# Altium project matrix_8x8_74hc595.PrjPcb
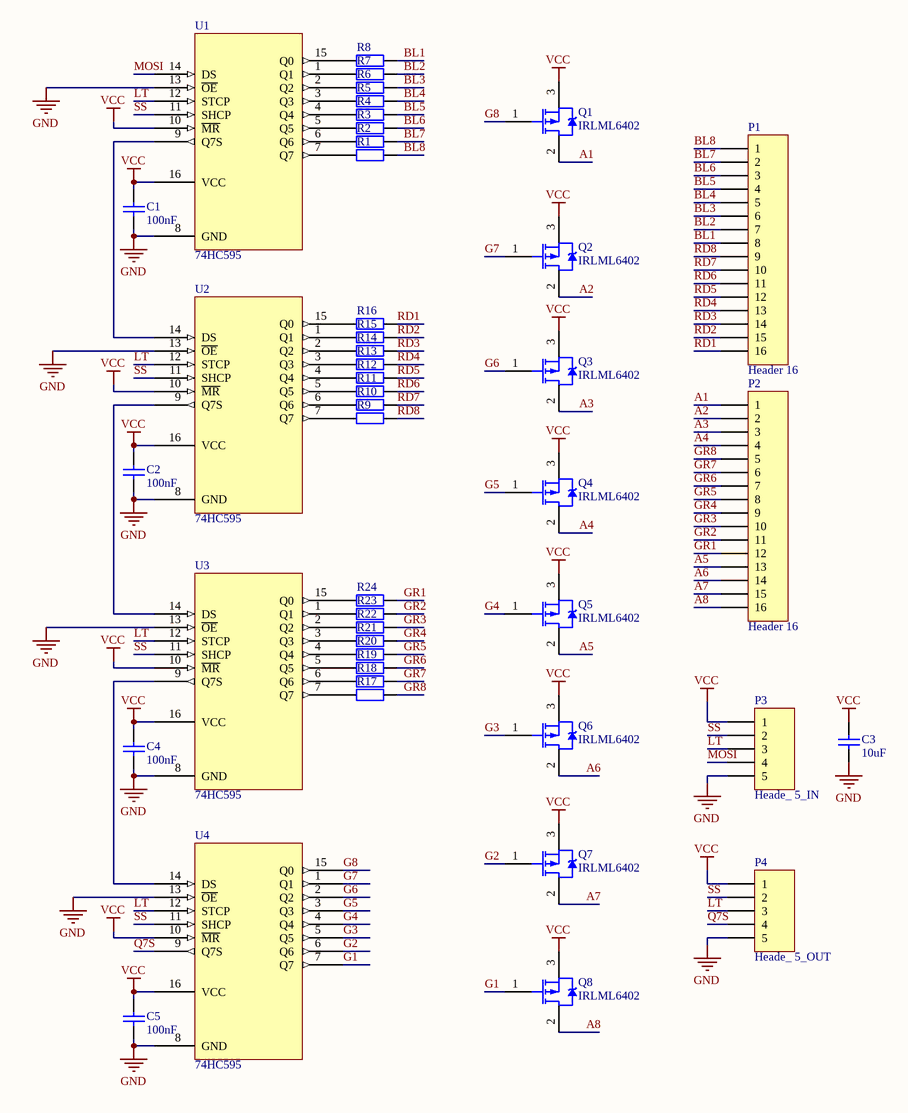
[diagram p0: schematic.SchDoc]
2 sheets, 149 parts. Net scope: global (net labels, ports and power ports of the same name join across sheets).
Board files: BOARD.PcbDoc, PRINT.PcbDoc
Sheets:
  schematic.SchDoc
  matrix_sh.SchDoc

## Sheet schematic.SchDoc
size A3

### Parts
(Parts that share a designator on the sheet are numbered #1, #2 ... from top to bottom, then left to right.)
C1#1  value 100nF  [6-0805_M]  (hidden comment: Cap)
C2#1  value 100nF  [6-0805_M]  (hidden comment: Cap)
C3#1  value 10uF  [6-0805_M]  (hidden comment: Cap)
C4#1  value 100nF  [6-0805_M]  (hidden comment: Cap)
C5  value 100nF  [6-0805_M]  (hidden comment: Cap)
P1  Header 16  [HDR1X16]
P2  Header 16  [HDR1X16]
P3  Heade_ 5_IN  [HDR1X5]
P4  Heade_ 5_OUT  [HDR1X5]
Q1#1  IRLML6402  [SOT95P237X112-3N]
Q2#1  IRLML6402  [SOT95P237X112-3N]
Q3#1  IRLML6402  [SOT95P237X112-3N]
Q4#1  IRLML6402  [SOT95P237X112-3N]
Q5#1  IRLML6402  [SOT95P237X112-3N]
Q6#1  IRLML6402  [SOT95P237X112-3N]
Q7#1  IRLML6402  [SOT95P237X112-3N]
Q8#1  IRLML6402  [SOT95P237X112-3N]
R1#1  Res2  [6-0805_M]  (value not drawn)
R2#1  Res2  [6-0805_M]  (value not drawn)
R3#1  Res2  [6-0805_M]  (value not drawn)
R4#1  Res2  [6-0805_M]  (value not drawn)
R5#1  Res2  [6-0805_M]  (value not drawn)
R6#1  Res2  [6-0805_M]  (value not drawn)
R7#1  Res2  [6-0805_M]  (value not drawn)
R8#1  Res2  [6-0805_M]  (value not drawn)
R9#1  Res2  [6-0805_M]  (value not drawn)
R10#1  Res2  [6-0805_M]  (value not drawn)
R11#1  Res2  [6-0805_M]  (value not drawn)
R12#1  Res2  [6-0805_M]  (value not drawn)
R13#1  Res2  [6-0805_M]  (value not drawn)
R14#1  Res2  [6-0805_M]  (value not drawn)
R15#1  Res2  [6-0805_M]  (value not drawn)
R16#1  Res2  [6-0805_M]  (value not drawn)
R17#1  Res2  [6-0805_M]  (value not drawn)
R18#1  Res2  [6-0805_M]  (value not drawn)
R19#1  Res2  [6-0805_M]  (value not drawn)
R20#1  Res2  [6-0805_M]  (value not drawn)
R21#1  Res2  [6-0805_M]  (value not drawn)
R22#1  Res2  [6-0805_M]  (value not drawn)
R23#1  Res2  [6-0805_M]  (value not drawn)
R24#1  Res2  [6-0805_M]  (value not drawn)
U1#1  74HC595  [TSOP65P640X110-16M]
U2#1  74HC595  [TSOP65P640X110-16M]
U3#1  74HC595  [TSOP65P640X110-16M]
U4#1  74HC595  [TSOP65P640X110-16M]

### Nets
GND: C1#1.1 C2#1.1 C3#1.1 C4#1.1 C5.1 P3.5 P4.5 U1#1.8(GND) U1#1.13(~{OE}) U2#1.8(GND) U2#1.13(~{OE}) U3#1.8(GND) U3#1.13(~{OE}) U4#1.8(GND) U4#1.13(~{OE})
VCC: C1#1.2 C2#1.2 C3#1.2 C4#1.2 C5.2 P3.1 P4.1 Q1#1.3(S) Q2#1.3(S) Q3#1.3(S) Q4#1.3(S) Q5#1.3(S) Q6#1.3(S) Q7#1.3(S) Q8#1.3(S) U1#1.10(~{MR}) U1#1.16(VCC) U2#1.10(~{MR}) U2#1.16(VCC) U3#1.10(~{MR}) U3#1.16(VCC) U4#1.10(~{MR}) U4#1.16(VCC)
A1: P2.1 Q1#1.2(D)
A2: P2.2 Q2#1.2(D)
A3: P2.3 Q3#1.2(D)
A4: P2.4 Q4#1.2(D)
A5: P2.13 Q5#1.2(D)
A6: P2.14 Q6#1.2(D)
A7: P2.15 Q7#1.2(D)
A8: P2.16 Q8#1.2(D)
BL1: P1.8 R8#1.2
BL2: P1.7 R7#1.2
BL3: P1.6 R6#1.2
BL4: P1.5 R5#1.2
BL5: P1.4 R4#1.2
BL6: P1.3 R3#1.2
BL7: P1.2 R2#1.2
BL8: P1.1 R1#1.2
G1: Q8#1.1(G) U4#1.7(Q7)
G2: Q7#1.1(G) U4#1.6(Q6)
G3: Q6#1.1(G) U4#1.5(Q5)
G4: Q5#1.1(G) U4#1.4(Q4)
G5: Q4#1.1(G) U4#1.3(Q3)
G6: Q3#1.1(G) U4#1.2(Q2)
G7: Q2#1.1(G) U4#1.1(Q1)
G8: Q1#1.1(G) U4#1.15(Q0)
GR1: P2.12 R24#1.2
GR2: P2.11 R23#1.2
GR3: P2.10 R22#1.2
GR4: P2.9 R21#1.2
GR5: P2.8 R20#1.2
GR6: P2.7 R19#1.2
GR7: P2.6 R18#1.2
GR8: P2.5 R17#1.2
LT: P3.3 P4.3 U1#1.12(STCP) U2#1.12(STCP) U3#1.12(STCP) U4#1.12(STCP)
MOSI: P3.4 U1#1.14(DS)
Q7S: P4.4 U4#1.9(Q7S)
RD1: P1.16 R16#1.2
RD2: P1.15 R15#1.2
RD3: P1.14 R14#1.2
RD4: P1.13 R13#1.2
RD5: P1.12 R12#1.2
RD6: P1.11 R11#1.2
RD7: P1.10 R10#1.2
RD8: P1.9 R9#1.2
SS: P3.2 P4.2 U1#1.11(SHCP) U2#1.11(SHCP) U3#1.11(SHCP) U4#1.11(SHCP)
NetR1#1_1: R1#1.1 U1#1.7(Q7)
NetR2#1_1: R2#1.1 U1#1.6(Q6)
NetR3#1_1: R3#1.1 U1#1.5(Q5)
NetR4#1_1: R4#1.1 U1#1.4(Q4)
NetR5#1_1: R5#1.1 U1#1.3(Q3)
NetR6#1_1: R6#1.1 U1#1.2(Q2)
NetR7#1_1: R7#1.1 U1#1.1(Q1)
NetR8#1_1: R8#1.1 U1#1.15(Q0)
NetR9#1_1: R9#1.1 U2#1.7(Q7)
NetR10#1_1: R10#1.1 U2#1.6(Q6)
NetR11#1_1: R11#1.1 U2#1.5(Q5)
NetR12#1_1: R12#1.1 U2#1.4(Q4)
NetR13#1_1: R13#1.1 U2#1.3(Q3)
NetR14#1_1: R14#1.1 U2#1.2(Q2)
NetR15#1_1: R15#1.1 U2#1.1(Q1)
NetR16#1_1: R16#1.1 U2#1.15(Q0)
NetR17#1_1: R17#1.1 U3#1.7(Q7)
NetR18#1_1: R18#1.1 U3#1.6(Q6)
NetR19#1_1: R19#1.1 U3#1.5(Q5)
NetR20#1_1: R20#1.1 U3#1.4(Q4)
NetR21#1_1: R21#1.1 U3#1.3(Q3)
NetR22#1_1: R22#1.1 U3#1.2(Q2)
NetR23#1_1: R23#1.1 U3#1.1(Q1)
NetR24#1_1: R24#1.1 U3#1.15(Q0)
NetU1#1_9: U1#1.9(Q7S) U2#1.14(DS)
NetU2#1_9: U2#1.9(Q7S) U3#1.14(DS)
NetU3#1_9: U3#1.9(Q7S) U4#1.14(DS)

### Library data of the parts
C1#1 C2#1 C3#1 C4#1 C5 = Cap: Capacitor; Published: 8-Jun-2000; LatestRevisionDate: 17-Jul-2002; LatestRevisionNote: Re-released for DXP Platform.; PackageReference: RAD-0.3; Publisher: Altium Limited; PackageDescription: Radial Cap, Thru-Hole; 2 Leads; 0.3 in Pin Spacing
P1 P2 = Header 16: Header, 16-Pin; LatestRevisionDate: 17-Jul-2002; LatestRevisionNote: Re-released for DXP Platform.; Publisher: Altium Limited
P3 P4 = Header 5: Header, 5-Pin; LatestRevisionDate: 17-Jul-2002; LatestRevisionNote: Re-released for DXP Platform.; Publisher: Altium Limited
R1#1 R2#1 R3#1 R4#1 R5#1 R6#1 R7#1 R8#1 R18#1 R19#1 R20#1 R21#1 R22#1 R23#1 R24#1 = Res2: Resistor; Value: 33; Published: 8-Jun-2000; LatestRevisionDate: 17-Jul-2002; LatestRevisionNote: Re-released for DXP Platform.; PackageReference: AXIAL-0.4; Publisher: Altium Limited; PackageDescription: Axial Device, Thru-Hole; 2 Leads; 0.4 in Pin Spacing
R9#1 R10#1 R11#1 R12#1 R13#1 R14#1 R15#1 R16#1 = Res2: Resistor; Value: 130; Published: 8-Jun-2000; LatestRevisionDate: 17-Jul-2002; LatestRevisionNote: Re-released for DXP Platform.; PackageReference: AXIAL-0.4; Publisher: Altium Limited; PackageDescription: Axial Device, Thru-Hole; 2 Leads; 0.4 in Pin Spacing
R17#1 = Res2: Resistor; Value: 30; Published: 8-Jun-2000; LatestRevisionDate: 17-Jul-2002; LatestRevisionNote: Re-released for DXP Platform.; PackageReference: AXIAL-0.4; Publisher: Altium Limited; PackageDescription: Axial Device, Thru-Hole; 2 Leads; 0.4 in Pin Spacing
U1#1 U2#1 U3#1 U4#1 = 74HC595: NXP

## Sheet matrix_sh.SchDoc
size A2 portrait
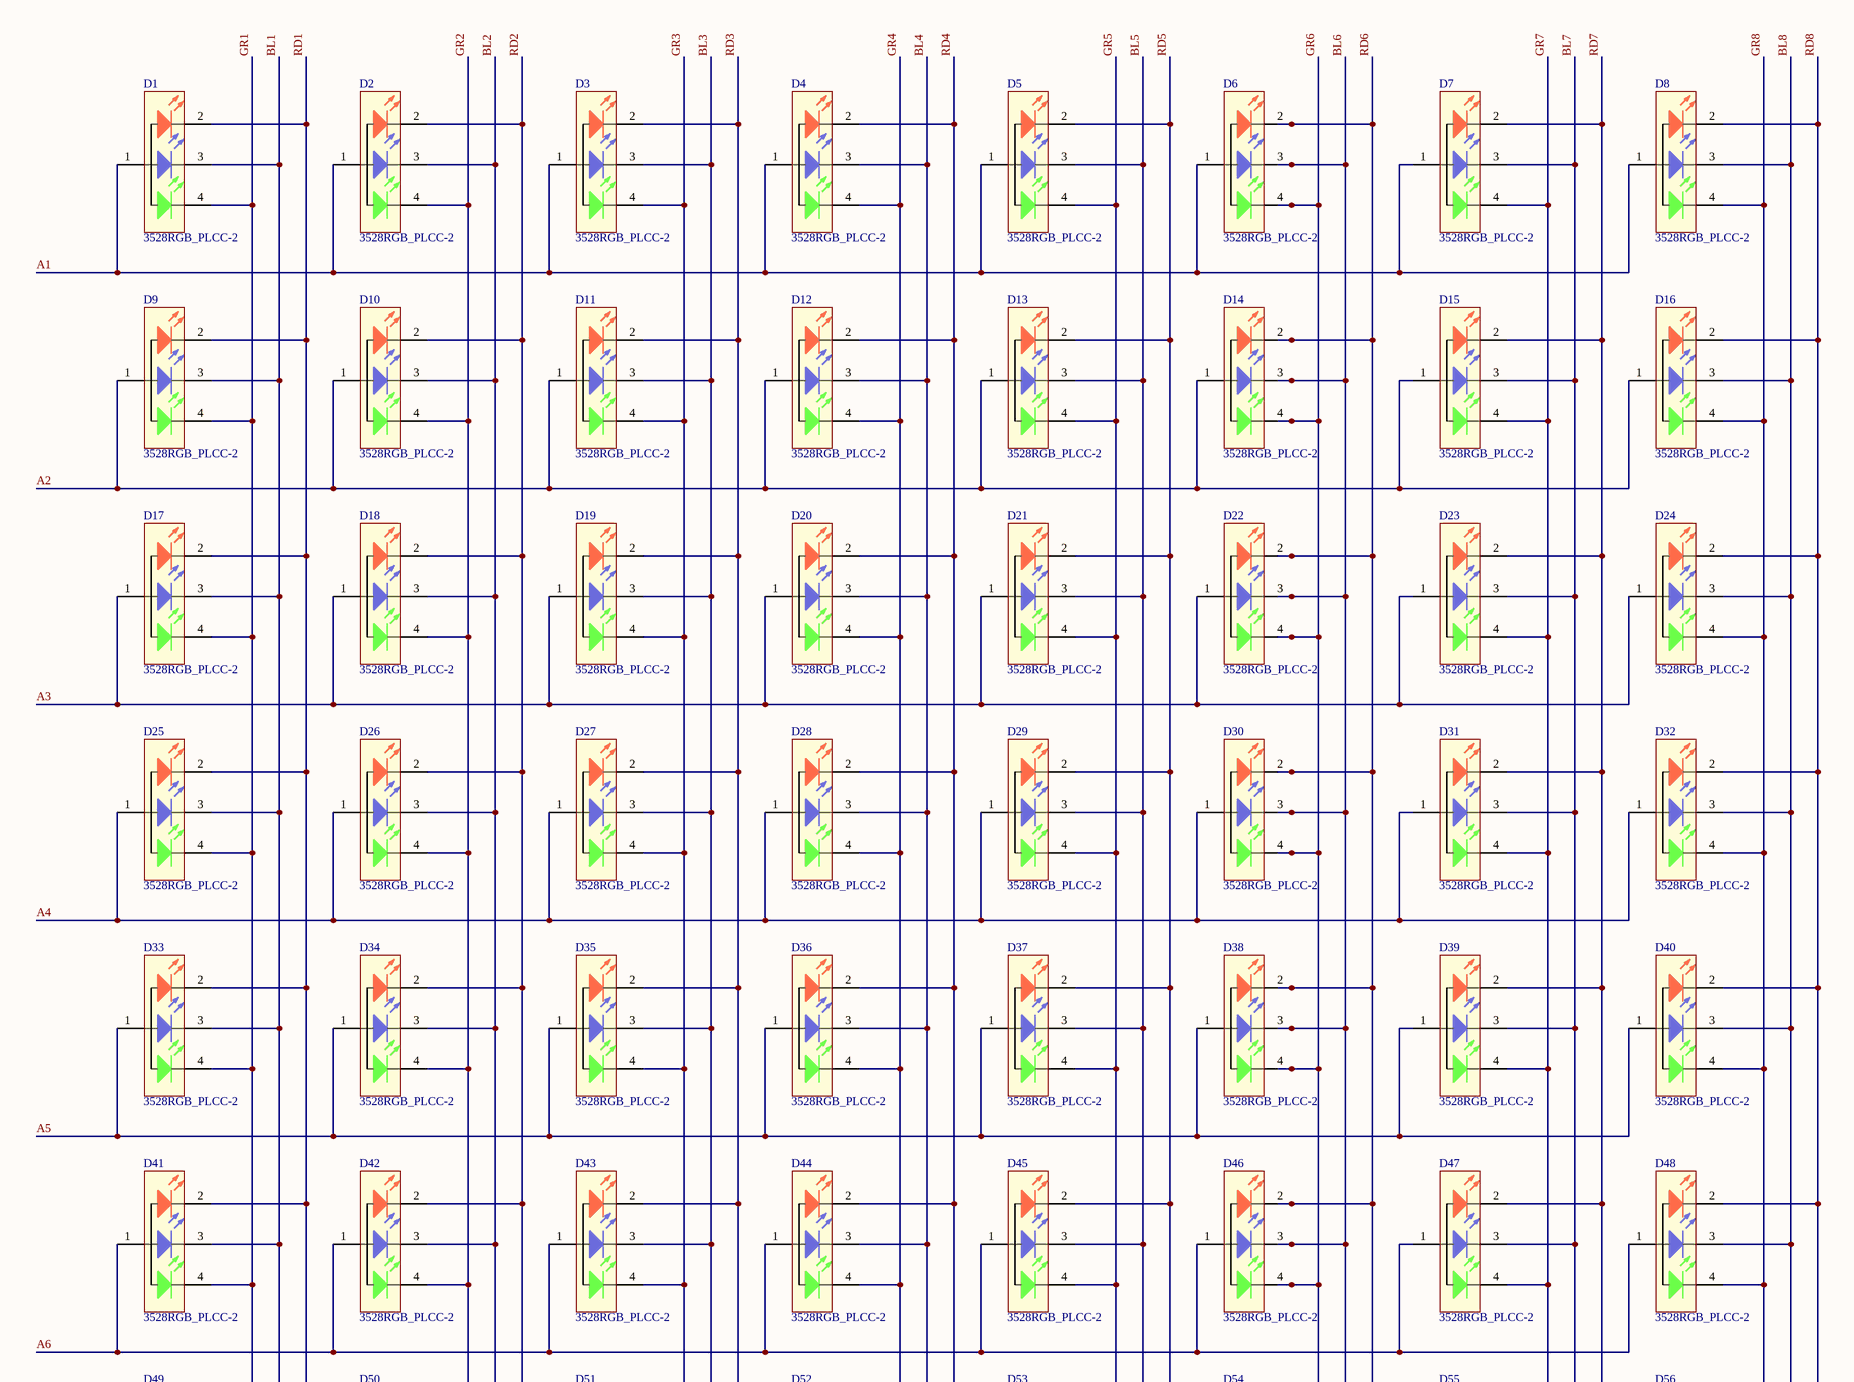
[diagram p1: matrix_sh.SchDoc, top]
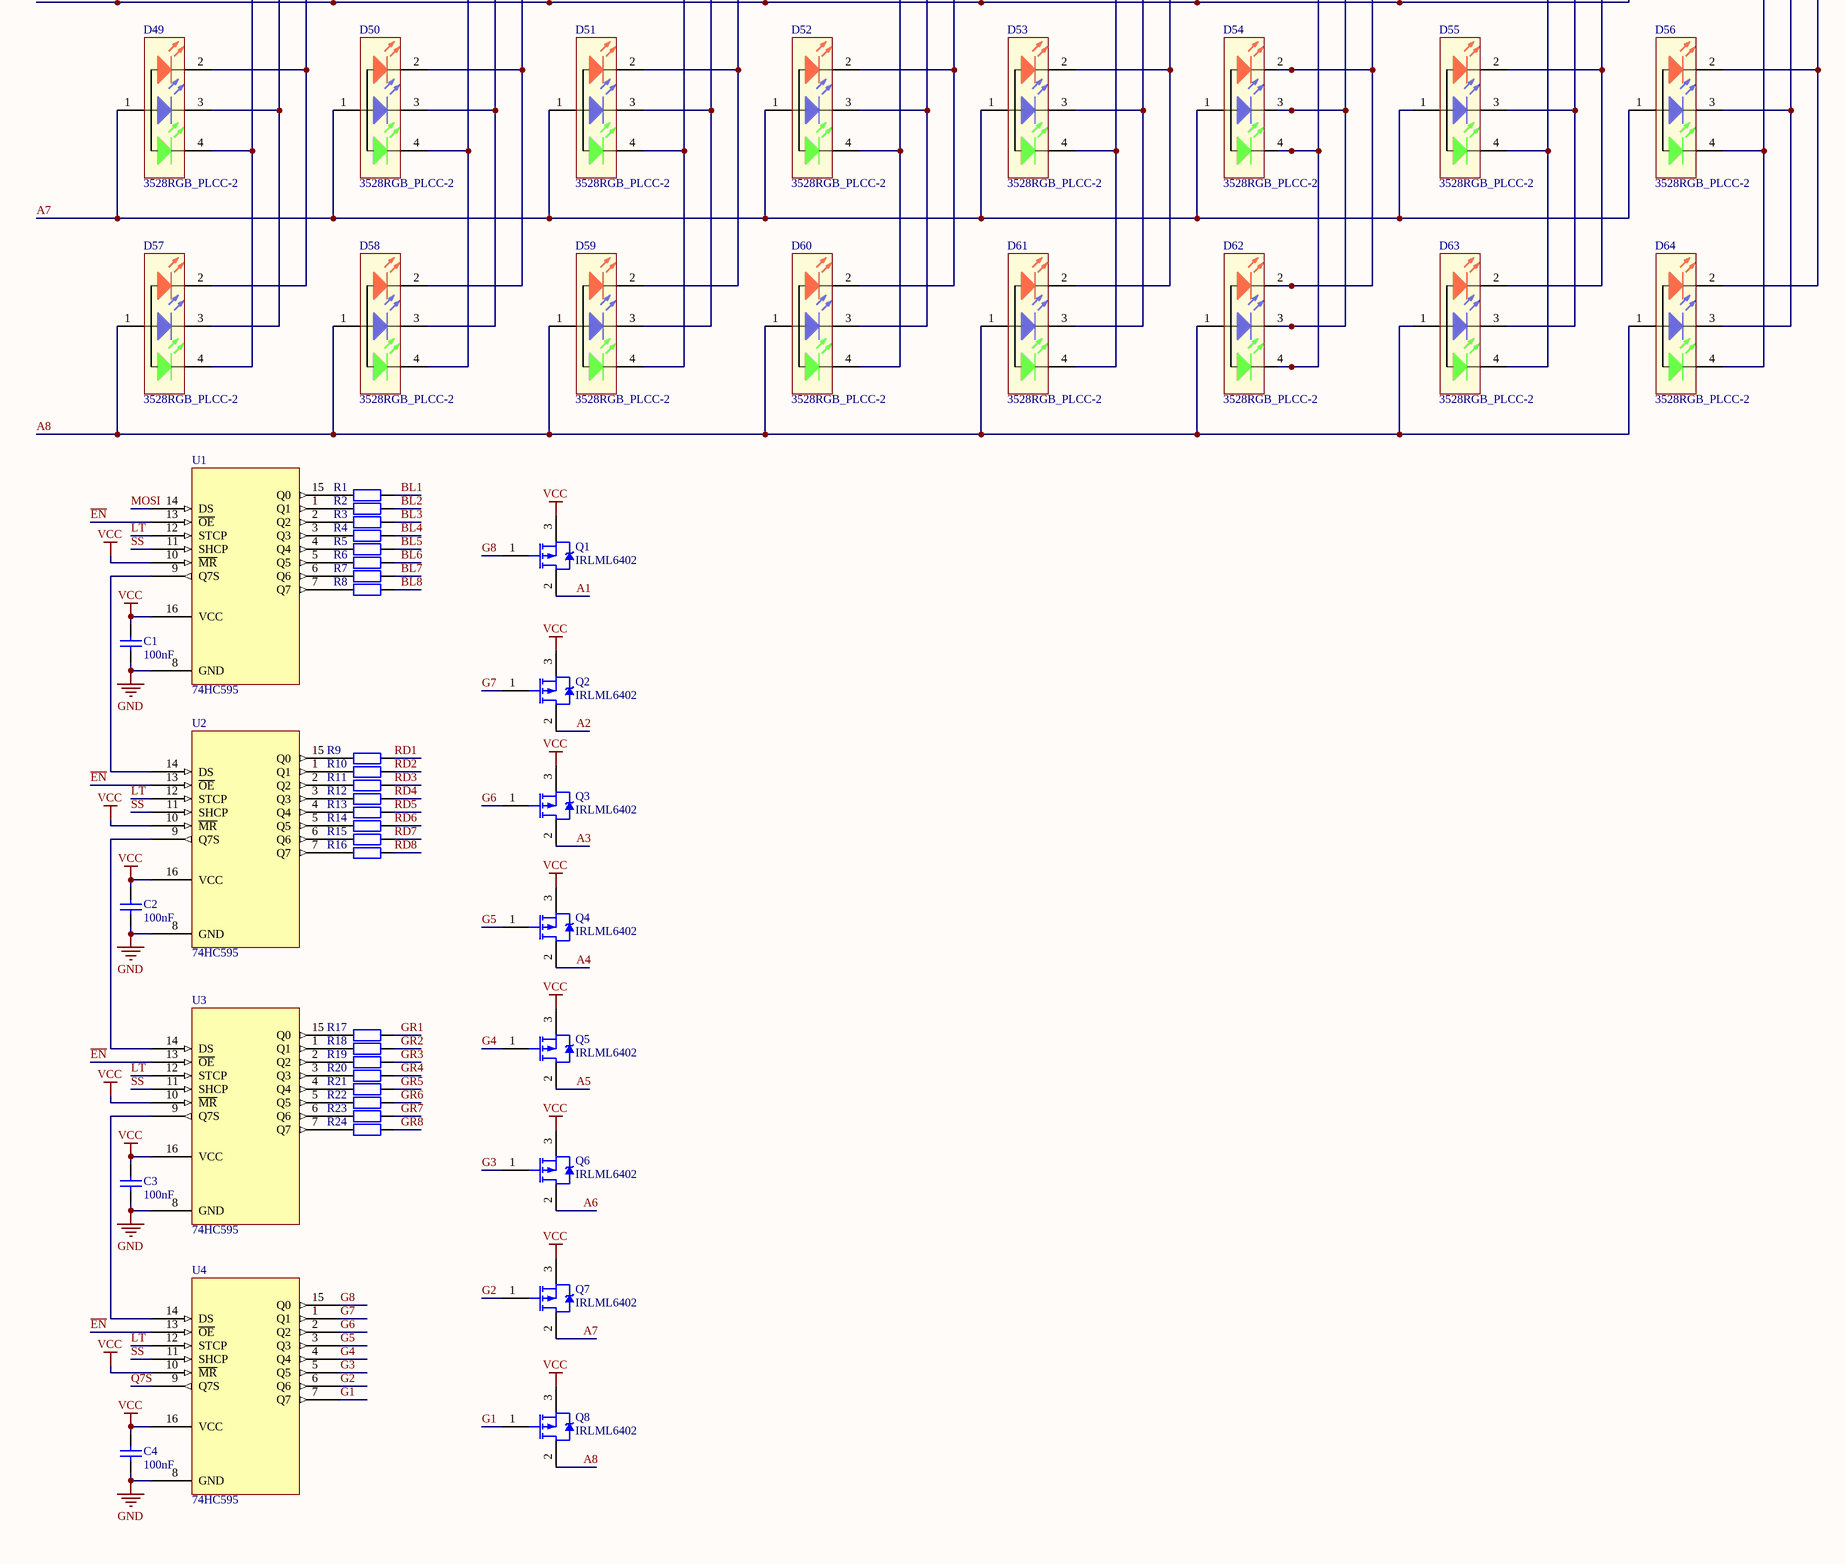
[diagram p2: matrix_sh.SchDoc, bottom]

### Parts
(Parts that share a designator on the sheet are numbered #1, #2 ... from top to bottom, then left to right.)
C1#2  value 100nF  [6-0805_M]  (hidden comment: Cap)
C2#2  value 100nF  [6-0805_M]  (hidden comment: Cap)
C3#2  value 100nF  [6-0805_M]  (hidden comment: Cap)
C4#2  value 100nF  [6-0805_M]  (hidden comment: Cap)
D1  3528RGB_PLCC-2  [PLCC-4 3528]
D2  3528RGB_PLCC-2  [PLCC-4 3528]
D3  3528RGB_PLCC-2  [PLCC-4 3528]
D4  3528RGB_PLCC-2  [PLCC-4 3528]
D5  3528RGB_PLCC-2  [PLCC-4 3528]
D6  3528RGB_PLCC-2  [PLCC-4 3528]
D7  3528RGB_PLCC-2  [PLCC-4 3528]
D8  3528RGB_PLCC-2  [PLCC-4 3528]
D9  3528RGB_PLCC-2  [PLCC-4 3528]
D10  3528RGB_PLCC-2  [PLCC-4 3528]
D11  3528RGB_PLCC-2  [PLCC-4 3528]
D12  3528RGB_PLCC-2  [PLCC-4 3528]
D13  3528RGB_PLCC-2  [PLCC-4 3528]
D14  3528RGB_PLCC-2  [PLCC-4 3528]
D15  3528RGB_PLCC-2  [PLCC-4 3528]
D16  3528RGB_PLCC-2  [PLCC-4 3528]
D17  3528RGB_PLCC-2  [PLCC-4 3528]
D18  3528RGB_PLCC-2  [PLCC-4 3528]
D19  3528RGB_PLCC-2  [PLCC-4 3528]
D20  3528RGB_PLCC-2  [PLCC-4 3528]
D21  3528RGB_PLCC-2  [PLCC-4 3528]
D22  3528RGB_PLCC-2  [PLCC-4 3528]
D23  3528RGB_PLCC-2  [PLCC-4 3528]
D24  3528RGB_PLCC-2  [PLCC-4 3528]
D25  3528RGB_PLCC-2  [PLCC-4 3528]
D26  3528RGB_PLCC-2  [PLCC-4 3528]
D27  3528RGB_PLCC-2  [PLCC-4 3528]
D28  3528RGB_PLCC-2  [PLCC-4 3528]
D29  3528RGB_PLCC-2  [PLCC-4 3528]
D30  3528RGB_PLCC-2  [PLCC-4 3528]
D31  3528RGB_PLCC-2  [PLCC-4 3528]
D32  3528RGB_PLCC-2  [PLCC-4 3528]
D33  3528RGB_PLCC-2  [PLCC-4 3528]
D34  3528RGB_PLCC-2  [PLCC-4 3528]
D35  3528RGB_PLCC-2  [PLCC-4 3528]
D36  3528RGB_PLCC-2  [PLCC-4 3528]
D37  3528RGB_PLCC-2  [PLCC-4 3528]
D38  3528RGB_PLCC-2  [PLCC-4 3528]
D39  3528RGB_PLCC-2  [PLCC-4 3528]
D40  3528RGB_PLCC-2  [PLCC-4 3528]
D41  3528RGB_PLCC-2  [PLCC-4 3528]
D42  3528RGB_PLCC-2  [PLCC-4 3528]
D43  3528RGB_PLCC-2  [PLCC-4 3528]
D44  3528RGB_PLCC-2  [PLCC-4 3528]
D45  3528RGB_PLCC-2  [PLCC-4 3528]
D46  3528RGB_PLCC-2  [PLCC-4 3528]
D47  3528RGB_PLCC-2  [PLCC-4 3528]
D48  3528RGB_PLCC-2  [PLCC-4 3528]
D49  3528RGB_PLCC-2  [PLCC-4 3528]
D50  3528RGB_PLCC-2  [PLCC-4 3528]
D51  3528RGB_PLCC-2  [PLCC-4 3528]
D52  3528RGB_PLCC-2  [PLCC-4 3528]
D53  3528RGB_PLCC-2  [PLCC-4 3528]
D54  3528RGB_PLCC-2  [PLCC-4 3528]
D55  3528RGB_PLCC-2  [PLCC-4 3528]
D56  3528RGB_PLCC-2  [PLCC-4 3528]
D57  3528RGB_PLCC-2  [PLCC-4 3528]
D58  3528RGB_PLCC-2  [PLCC-4 3528]
D59  3528RGB_PLCC-2  [PLCC-4 3528]
D60  3528RGB_PLCC-2  [PLCC-4 3528]
D61  3528RGB_PLCC-2  [PLCC-4 3528]
D62  3528RGB_PLCC-2  [PLCC-4 3528]
D63  3528RGB_PLCC-2  [PLCC-4 3528]
D64  3528RGB_PLCC-2  [PLCC-4 3528]
Q1#2  IRLML6402  [SOT95P237X112-3N]
Q2#2  IRLML6402  [SOT95P237X112-3N]
Q3#2  IRLML6402  [SOT95P237X112-3N]
Q4#2  IRLML6402  [SOT95P237X112-3N]
Q5#2  IRLML6402  [SOT95P237X112-3N]
Q6#2  IRLML6402  [SOT95P237X112-3N]
Q7#2  IRLML6402  [SOT95P237X112-3N]
Q8#2  IRLML6402  [SOT95P237X112-3N]
R1#2  Res2  [6-0805_M]  (value not drawn)
R2#2  Res2  [6-0805_M]  (value not drawn)
R3#2  Res2  [6-0805_M]  (value not drawn)
R4#2  Res2  [6-0805_M]  (value not drawn)
R5#2  Res2  [6-0805_M]  (value not drawn)
R6#2  Res2  [6-0805_M]  (value not drawn)
R7#2  Res2  [6-0805_M]  (value not drawn)
R8#2  Res2  [6-0805_M]  (value not drawn)
R9#2  Res2  [6-0805_M]  (value not drawn)
R10#2  Res2  [6-0805_M]  (value not drawn)
R11#2  Res2  [6-0805_M]  (value not drawn)
R12#2  Res2  [6-0805_M]  (value not drawn)
R13#2  Res2  [6-0805_M]  (value not drawn)
R14#2  Res2  [6-0805_M]  (value not drawn)
R15#2  Res2  [6-0805_M]  (value not drawn)
R16#2  Res2  [6-0805_M]  (value not drawn)
R17#2  Res2  [6-0805_M]  (value not drawn)
R18#2  Res2  [6-0805_M]  (value not drawn)
R19#2  Res2  [6-0805_M]  (value not drawn)
R20#2  Res2  [6-0805_M]  (value not drawn)
R21#2  Res2  [6-0805_M]  (value not drawn)
R22#2  Res2  [6-0805_M]  (value not drawn)
R23#2  Res2  [6-0805_M]  (value not drawn)
R24#2  Res2  [6-0805_M]  (value not drawn)
U1#2  74HC595  [TSOP65P640X110-16M]
U2#2  74HC595  [TSOP65P640X110-16M]
U3#2  74HC595  [TSOP65P640X110-16M]
U4#2  74HC595  [TSOP65P640X110-16M]

### Nets
GND: C1#2.1 C2#2.1 C3#2.1 C4#2.1 U1#2.8(GND) U2#2.8(GND) U3#2.8(GND) U4#2.8(GND)
VCC: C1#2.2 C2#2.2 C3#2.2 C4#2.2 Q1#2.3(S) Q2#2.3(S) Q3#2.3(S) Q4#2.3(S) Q5#2.3(S) Q6#2.3(S) Q7#2.3(S) Q8#2.3(S) U1#2.10(~{MR}) U1#2.16(VCC) U2#2.10(~{MR}) U2#2.16(VCC) U3#2.10(~{MR}) U3#2.16(VCC) U4#2.10(~{MR}) U4#2.16(VCC)
A1: D1.1(A) D2.1(A) D3.1(A) D4.1(A) D5.1(A) D6.1(A) D7.1(A) D8.1(A) Q1#2.2(D)
A2: D9.1(A) D10.1(A) D11.1(A) D12.1(A) D13.1(A) D14.1(A) D15.1(A) D16.1(A) Q2#2.2(D)
A3: D17.1(A) D18.1(A) D19.1(A) D20.1(A) D21.1(A) D22.1(A) D23.1(A) D24.1(A) Q3#2.2(D)
A4: D25.1(A) D26.1(A) D27.1(A) D28.1(A) D29.1(A) D30.1(A) D31.1(A) D32.1(A) Q4#2.2(D)
A5: D33.1(A) D34.1(A) D35.1(A) D36.1(A) D37.1(A) D38.1(A) D39.1(A) D40.1(A) Q5#2.2(D)
A6: D41.1(A) D42.1(A) D43.1(A) D44.1(A) D45.1(A) D46.1(A) D47.1(A) D48.1(A) Q6#2.2(D)
A7: D49.1(A) D50.1(A) D51.1(A) D52.1(A) D53.1(A) D54.1(A) D55.1(A) D56.1(A) Q7#2.2(D)
A8: D57.1(A) D58.1(A) D59.1(A) D60.1(A) D61.1(A) D62.1(A) D63.1(A) D64.1(A) Q8#2.2(D)
BL1: D1.3(K) D9.3(K) D17.3(K) D25.3(K) D33.3(K) D41.3(K) D49.3(K) D57.3(K) R1#2.2
BL2: D2.3(K) D10.3(K) D18.3(K) D26.3(K) D34.3(K) D42.3(K) D50.3(K) D58.3(K) R2#2.2
BL3: D3.3(K) D11.3(K) D19.3(K) D27.3(K) D35.3(K) D43.3(K) D51.3(K) D59.3(K) R3#2.2
BL4: D4.3(K) D12.3(K) D20.3(K) D28.3(K) D36.3(K) D44.3(K) D52.3(K) D60.3(K) R4#2.2
BL5: D5.3(K) D13.3(K) D21.3(K) D29.3(K) D37.3(K) D45.3(K) D53.3(K) D61.3(K) R5#2.2
BL6: D6.3(K) D14.3(K) D22.3(K) D30.3(K) D38.3(K) D46.3(K) D54.3(K) D62.3(K) R6#2.2
BL7: D7.3(K) D15.3(K) D23.3(K) D31.3(K) D39.3(K) D47.3(K) D55.3(K) D63.3(K) R7#2.2
BL8: D8.3(K) D16.3(K) D24.3(K) D32.3(K) D40.3(K) D48.3(K) D56.3(K) D64.3(K) R8#2.2
~{EN}: U1#2.13(~{OE}) U2#2.13(~{OE}) U3#2.13(~{OE}) U4#2.13(~{OE})
G1: Q8#2.1(G) U4#2.7(Q7)
G2: Q7#2.1(G) U4#2.6(Q6)
G3: Q6#2.1(G) U4#2.5(Q5)
G4: Q5#2.1(G) U4#2.4(Q4)
G5: Q4#2.1(G) U4#2.3(Q3)
G6: Q3#2.1(G) U4#2.2(Q2)
G7: Q2#2.1(G) U4#2.1(Q1)
G8: Q1#2.1(G) U4#2.15(Q0)
GR1: D1.4(K) D9.4(K) D17.4(K) D25.4(K) D33.4(K) D41.4(K) D49.4(K) D57.4(K) R17#2.2
GR2: D2.4(K) D10.4(K) D18.4(K) D26.4(K) D34.4(K) D42.4(K) D50.4(K) D58.4(K) R18#2.2
GR3: D3.4(K) D11.4(K) D19.4(K) D27.4(K) D35.4(K) D43.4(K) D51.4(K) D59.4(K) R19#2.2
GR4: D4.4(K) D12.4(K) D20.4(K) D28.4(K) D36.4(K) D44.4(K) D52.4(K) D60.4(K) R20#2.2
GR5: D5.4(K) D13.4(K) D21.4(K) D29.4(K) D37.4(K) D45.4(K) D53.4(K) D61.4(K) R21#2.2
GR6: D6.4(K) D14.4(K) D22.4(K) D30.4(K) D38.4(K) D46.4(K) D54.4(K) D62.4(K) R22#2.2
GR7: D7.4(K) D15.4(K) D23.4(K) D31.4(K) D39.4(K) D47.4(K) D55.4(K) D63.4(K) R23#2.2
GR8: D8.4(K) D16.4(K) D24.4(K) D32.4(K) D40.4(K) D48.4(K) D56.4(K) D64.4(K) R24#2.2
LT: U1#2.12(STCP) U2#2.12(STCP) U3#2.12(STCP) U4#2.12(STCP)
MOSI: U1#2.14(DS)
Q7S: U4#2.9(Q7S)
RD1: D1.2(K) D9.2(K) D17.2(K) D25.2(K) D33.2(K) D41.2(K) D49.2(K) D57.2(K) R9#2.2
RD2: D2.2(K) D10.2(K) D18.2(K) D26.2(K) D34.2(K) D42.2(K) D50.2(K) D58.2(K) R10#2.2
RD3: D3.2(K) D11.2(K) D19.2(K) D27.2(K) D35.2(K) D43.2(K) D51.2(K) D59.2(K) R11#2.2
RD4: D4.2(K) D12.2(K) D20.2(K) D28.2(K) D36.2(K) D44.2(K) D52.2(K) D60.2(K) R12#2.2
RD5: D5.2(K) D13.2(K) D21.2(K) D29.2(K) D37.2(K) D45.2(K) D53.2(K) D61.2(K) R13#2.2
RD6: D6.2(K) D14.2(K) D22.2(K) D30.2(K) D38.2(K) D46.2(K) D54.2(K) D62.2(K) R14#2.2
RD7: D7.2(K) D15.2(K) D23.2(K) D31.2(K) D39.2(K) D47.2(K) D55.2(K) D63.2(K) R15#2.2
RD8: D8.2(K) D16.2(K) D24.2(K) D32.2(K) D40.2(K) D48.2(K) D56.2(K) D64.2(K) R16#2.2
SS: U1#2.11(SHCP) U2#2.11(SHCP) U3#2.11(SHCP) U4#2.11(SHCP)
NetR1#2_1: R1#2.1 U1#2.15(Q0)
NetR2#2_1: R2#2.1 U1#2.1(Q1)
NetR3#2_1: R3#2.1 U1#2.2(Q2)
NetR4#2_1: R4#2.1 U1#2.3(Q3)
NetR5#2_1: R5#2.1 U1#2.4(Q4)
NetR6#2_1: R6#2.1 U1#2.5(Q5)
NetR7#2_1: R7#2.1 U1#2.6(Q6)
NetR8#2_1: R8#2.1 U1#2.7(Q7)
NetR9#2_1: R9#2.1 U2#2.15(Q0)
NetR10#2_1: R10#2.1 U2#2.1(Q1)
NetR11#2_1: R11#2.1 U2#2.2(Q2)
NetR12#2_1: R12#2.1 U2#2.3(Q3)
NetR13#2_1: R13#2.1 U2#2.4(Q4)
NetR14#2_1: R14#2.1 U2#2.5(Q5)
NetR15#2_1: R15#2.1 U2#2.6(Q6)
NetR16#2_1: R16#2.1 U2#2.7(Q7)
NetR17#2_1: R17#2.1 U3#2.15(Q0)
NetR18#2_1: R18#2.1 U3#2.1(Q1)
NetR19#2_1: R19#2.1 U3#2.2(Q2)
NetR20#2_1: R20#2.1 U3#2.3(Q3)
NetR21#2_1: R21#2.1 U3#2.4(Q4)
NetR22#2_1: R22#2.1 U3#2.5(Q5)
NetR23#2_1: R23#2.1 U3#2.6(Q6)
NetR24#2_1: R24#2.1 U3#2.7(Q7)
NetU1#2_9: U1#2.9(Q7S) U2#2.14(DS)
NetU2#2_9: U2#2.9(Q7S) U3#2.14(DS)
NetU3#2_9: U3#2.9(Q7S) U4#2.14(DS)

### Library data of the parts
C1#2 C2#2 C3#2 C4#2 = Cap: Capacitor; Published: 8-Jun-2000; LatestRevisionDate: 17-Jul-2002; LatestRevisionNote: Re-released for DXP Platform.; PackageReference: RAD-0.3; Publisher: Altium Limited; PackageDescription: Radial Cap, Thru-Hole; 2 Leads; 0.3 in Pin Spacing
R1#2 R2#2 R3#2 R4#2 R5#2 R6#2 R7#2 R8#2 R17#2 R18#2 R19#2 R20#2 R21#2 R22#2 R23#2 R24#2 = Res2: Resistor; Value: 15; Published: 8-Jun-2000; LatestRevisionDate: 17-Jul-2002; LatestRevisionNote: Re-released for DXP Platform.; PackageReference: AXIAL-0.4; Publisher: Altium Limited; PackageDescription: Axial Device, Thru-Hole; 2 Leads; 0.4 in Pin Spacing
R9#2 R10#2 R11#2 R12#2 R13#2 R14#2 R15#2 R16#2 = Res2: Resistor; Value: 68; Published: 8-Jun-2000; LatestRevisionDate: 17-Jul-2002; LatestRevisionNote: Re-released for DXP Platform.; PackageReference: AXIAL-0.4; Publisher: Altium Limited; PackageDescription: Axial Device, Thru-Hole; 2 Leads; 0.4 in Pin Spacing
U1#2 U2#2 U3#2 U4#2 = 74HC595: NXP

## Nets that join several sheets
GND: schematic (15 pins), matrix_sh (8 pins)
VCC: schematic (23 pins), matrix_sh (20 pins)
A1: schematic (P2.1 Q1#1.2), matrix_sh (9 pins)
A2: schematic (P2.2 Q2#1.2), matrix_sh (9 pins)
A3: schematic (P2.3 Q3#1.2), matrix_sh (9 pins)
A4: schematic (P2.4 Q4#1.2), matrix_sh (9 pins)
A5: schematic (P2.13 Q5#1.2), matrix_sh (9 pins)
A6: schematic (P2.14 Q6#1.2), matrix_sh (9 pins)
A7: schematic (P2.15 Q7#1.2), matrix_sh (9 pins)
A8: schematic (P2.16 Q8#1.2), matrix_sh (9 pins)
BL1: schematic (P1.8 R8#1.2), matrix_sh (9 pins)
BL2: schematic (P1.7 R7#1.2), matrix_sh (9 pins)
BL3: schematic (P1.6 R6#1.2), matrix_sh (9 pins)
BL4: schematic (P1.5 R5#1.2), matrix_sh (9 pins)
BL5: schematic (P1.4 R4#1.2), matrix_sh (9 pins)
BL6: schematic (P1.3 R3#1.2), matrix_sh (9 pins)
BL7: schematic (P1.2 R2#1.2), matrix_sh (9 pins)
BL8: schematic (P1.1 R1#1.2), matrix_sh (9 pins)
G1: schematic (Q8#1.1 U4#1.7), matrix_sh (Q8#2.1 U4#2.7)
G2: schematic (Q7#1.1 U4#1.6), matrix_sh (Q7#2.1 U4#2.6)
G3: schematic (Q6#1.1 U4#1.5), matrix_sh (Q6#2.1 U4#2.5)
G4: schematic (Q5#1.1 U4#1.4), matrix_sh (Q5#2.1 U4#2.4)
G5: schematic (Q4#1.1 U4#1.3), matrix_sh (Q4#2.1 U4#2.3)
G6: schematic (Q3#1.1 U4#1.2), matrix_sh (Q3#2.1 U4#2.2)
G7: schematic (Q2#1.1 U4#1.1), matrix_sh (Q2#2.1 U4#2.1)
G8: schematic (Q1#1.1 U4#1.15), matrix_sh (Q1#2.1 U4#2.15)
GR1: schematic (P2.12 R24#1.2), matrix_sh (9 pins)
GR2: schematic (P2.11 R23#1.2), matrix_sh (9 pins)
GR3: schematic (P2.10 R22#1.2), matrix_sh (9 pins)
GR4: schematic (P2.9 R21#1.2), matrix_sh (9 pins)
GR5: schematic (P2.8 R20#1.2), matrix_sh (9 pins)
GR6: schematic (P2.7 R19#1.2), matrix_sh (9 pins)
GR7: schematic (P2.6 R18#1.2), matrix_sh (9 pins)
GR8: schematic (P2.5 R17#1.2), matrix_sh (9 pins)
LT: schematic (6 pins), matrix_sh (U1#2.12 U2#2.12 U3#2.12 U4#2.12)
MOSI: schematic (P3.4 U1#1.14), matrix_sh (U1#2.14)
Q7S: schematic (P4.4 U4#1.9), matrix_sh (U4#2.9)
RD1: schematic (P1.16 R16#1.2), matrix_sh (9 pins)
RD2: schematic (P1.15 R15#1.2), matrix_sh (9 pins)
RD3: schematic (P1.14 R14#1.2), matrix_sh (9 pins)
RD4: schematic (P1.13 R13#1.2), matrix_sh (9 pins)
RD5: schematic (P1.12 R12#1.2), matrix_sh (9 pins)
RD6: schematic (P1.11 R11#1.2), matrix_sh (9 pins)
RD7: schematic (P1.10 R10#1.2), matrix_sh (9 pins)
RD8: schematic (P1.9 R9#1.2), matrix_sh (9 pins)
SS: schematic (6 pins), matrix_sh (U1#2.11 U2#2.11 U3#2.11 U4#2.11)